# EAGLE design spinduino-apa102 (EAGLE 8.2.2)
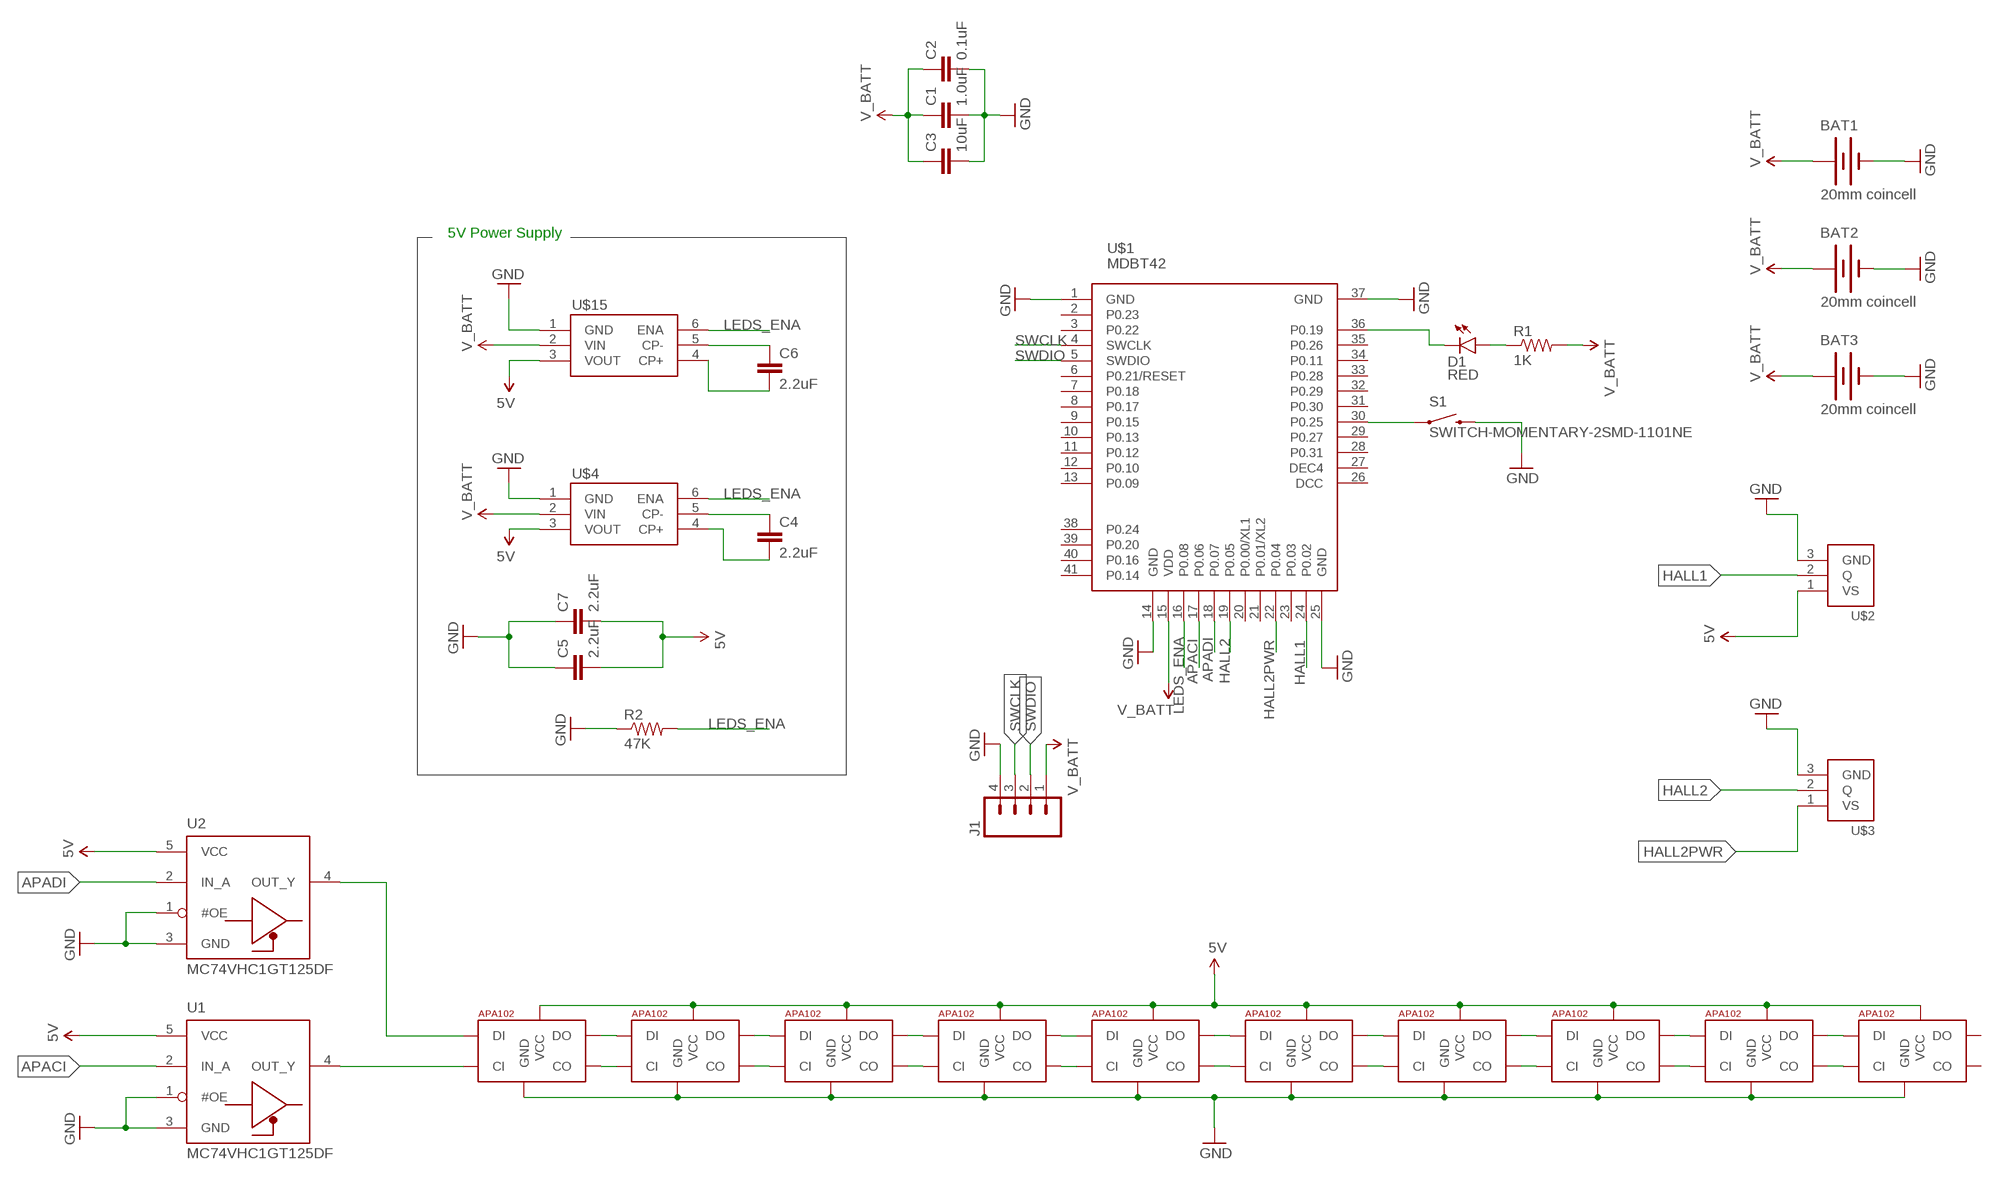
[diagram p0: schematic, sheet 1]

## Parts
BAT1  20mm coincell  BATTERY20MM_4LEGS  [BATTCON_20MM_4LEGS]
BAT2  20mm coincell  BATTERY20MM_4LEGS  [BATTCON_20MM_4LEGS]
BAT3  20mm coincell  BATTERY20MM_4LEGS  [BATTCON_20MM_4LEGS]
C1  1.0uF  1.0UF-16V-10%(0603)  [0603-CAP]
C2  0.1uF  0.1UF-25V-5%(0603)  [0603-CAP]
C3  10uF  10UF-6.3V-20%(0603)  [0603-CAP]
C4  2.2uF  2.2UF-10V-20%(0603)  [0603-CAP]
C5  2.2uF  10UF-6.3V-20%(0603)  [0603-CAP]
C6  2.2uF  2.2UF-10V-20%(0603)  [0603-CAP]
C7  2.2uF  10UF-6.3V-20%(0603)  [0603-CAP]
D1  RED  LED-RED0603  [LED-0603]
J1  M04LOCK  [1X04_LOCK]
R1  1K  1KOHM-1/10W-1%(0603)  [0603-RES]
R2  47K  1KOHM-1/10W-1%(0603)  [0603-RES]
S1  SWITCH-MOMENTARY-2SMD-1101NE  [TACTILE-SWITCH-1101NE]
U1  MC74VHC1GT125DF  [SOT353]
U2  MC74VHC1GT125DF  [SOT353]
U$1  MDBT42  [MDBT42]
U$2  TLE4946-2KSMD  [SC-59]
U$3  TLE4946-2KSMD  [SC-59]
U$4  TPS60150  [WSON6]
U$5  APA1022020  [APA102_2020]
U$6  APA1022020  [APA102_2020]
U$7  APA1022020  [APA102_2020]
U$8  APA1022020  [APA102_2020]
U$9  APA1022020  [APA102_2020]
U$10  APA1022020  [APA102_2020]
U$11  APA1022020  [APA102_2020]
U$12  APA1022020  [APA102_2020]
U$13  APA1022020  [APA102_2020]
U$14  APA1022020  [APA102_2020]
U$15  TPS60150  [WSON6]

## Nets
5V: C5.2 C7.2 U1.5(VCC) U2.5(VCC) U$2.1(VS) U$4.3(VOUT) U$5.V_CC(VCC) U$6.V_CC(VCC) U$7.V_CC(VCC) U$8.V_CC(VCC) U$9.V_CC(VCC) U$10.V_CC(VCC) U$11.V_CC(VCC) U$12.V_CC(VCC) U$13.V_CC(VCC) U$14.V_CC(VCC) U$15.3(VOUT)
APACI: U1.2(IN_A) U$1.17(P0.06)
APADI: U2.2(IN_A) U$1.18(P0.07)
GND: BAT1.NEGATIVE(-) BAT2.NEGATIVE(-) BAT3.NEGATIVE(-) C1.2 C2.2 C3.2 C5.1 C7.1 J1.4 R2.1 S1.2 U1.1(#OE) U1.3(GND) U2.1(#OE) U2.3(GND) U$1.1(GND) U$1.14(GND) U$1.25(GND) U$1.37(GND) U$2.3(GND) U$3.3(GND) U$4.1(GND) U$5.GND U$6.GND U$7.GND U$8.GND U$9.GND U$10.GND U$11.GND U$12.GND U$13.GND U$14.GND U$15.1(GND)
HALL1: U$1.24(P0.02) U$2.2(Q)
HALL2: U$1.19(P0.05) U$3.2(Q)
HALL2PWR: U$1.22(P0.04) U$3.1(VS)
LEDS_ENA: R2.2 U$1.16(P0.08) U$4.6(ENA) U$15.6(ENA)
N$1: U$10.C_IN(CI) U$11.CL_OUT(CO)
N$2: U$10.D_IN(DI) U$11.D_OUT(DO)
N$3: D1.C U$1.36(P0.19)
N$4: D1.A R1.1
N$5: U$5.D_IN(DI) U$6.D_OUT(DO)
N$6: U$5.C_IN(CI) U$6.CL_OUT(CO)
N$7: U$6.D_IN(DI) U$7.D_OUT(DO)
N$8: U$6.C_IN(CI) U$7.CL_OUT(CO)
N$9: U$7.D_IN(DI) U$8.D_OUT(DO)
N$10: U$7.C_IN(CI) U$8.CL_OUT(CO)
N$11: U$8.D_IN(DI) U$9.D_OUT(DO)
N$12: U$8.C_IN(CI) U$9.CL_OUT(CO)
N$13: U$9.D_IN(DI) U$10.D_OUT(DO)
N$14: U$9.C_IN(CI) U$10.CL_OUT(CO)
N$15: U$11.D_IN(DI) U$12.D_OUT(DO)
N$16: U$11.C_IN(CI) U$12.CL_OUT(CO)
N$17: U$12.D_IN(DI) U$13.D_OUT(DO)
N$18: U$12.C_IN(CI) U$13.CL_OUT(CO)
N$19: U$13.D_IN(DI) U$14.D_OUT(DO)
N$20: U$13.C_IN(CI) U$14.CL_OUT(CO)
N$21: S1.1 U$1.30(P0.25)
N$22: C4.2 U$4.4(CP+)
N$23: C4.1 U$4.5(CP-)
N$24: U2.4(OUT_Y) U$14.D_IN(DI)
N$25: U1.4(OUT_Y) U$14.C_IN(CI)
N$26: C6.1 U$15.5(CP-)
N$29: C6.2 U$15.4(CP+)
SWCLK: J1.3 U$1.4(SWCLK)
SWDIO: J1.2 U$1.5(SWDIO)
V_BATT: BAT1.POSITIVE@1(+) BAT1.POSITIVE@2(+) BAT1.POSITIVE@3(+) BAT1.POSITIVE@4(+) BAT2.POSITIVE@1(+) BAT2.POSITIVE@2(+) BAT2.POSITIVE@3(+) BAT2.POSITIVE@4(+) BAT3.POSITIVE@1(+) BAT3.POSITIVE@2(+) BAT3.POSITIVE@3(+) BAT3.POSITIVE@4(+) C1.1 C2.1 C3.1 J1.1 R1.2 U$1.15(VDD) U$4.2(VIN) U$15.2(VIN)
Unconnected: U$1.2(P0.23) U$1.3(P0.22) U$1.6(P0.21/RESET) U$1.7(P0.18) U$1.8(P0.17) U$1.9(P0.15) U$1.10(P0.13) U$1.11(P0.12) U$1.12(P0.10) U$1.13(P0.09) U$1.20(P0.00/XL1) U$1.21(P0.01/XL2) U$1.23(P0.03) U$1.26(DCC) U$1.27(DEC4) U$1.28(P0.31) U$1.29(P0.27) U$1.31(P0.30) U$1.32(P0.29) U$1.33(P0.28) U$1.34(P0.11) U$1.35(P0.26) U$1.38(P0.24) U$1.39(P0.20) U$1.40(P0.16) U$1.41(P0.14) U$5.CL_OUT(CO) U$5.D_OUT(DO)

## Notes on the sheet
- 5V Power Supply

## Library data of the parts
BAT1-BAT3 = ng-beacon:BATTERY: Battery Holders Various common sizes : AA, AAA, 18650 (PRT-12895), 20mm coin cell and 12mm coin cell. 20MM_4LEGS, BATT-10373; PROD_ID: BATT-10373
C1 = SparkFun-Capacitors:1.0UF-16V-10%(0603): CAP-00868; PROD_ID: CAP-00868
C2 = SparkFun-Capacitors:0.1UF-25V-5%(0603): CAP-08604; PROD_ID: CAP-08604
C3 = SparkFun-Capacitors:10UF-6.3V-20%(0603): CAP-11015; PROD_ID: CAP-11015
C4 C6 = SparkFun-Capacitors:2.2UF-10V-20%(0603): CAP-07888; PROD_ID: CAP-07888
C5 C7 = SparkFun-Capacitors:10UF-6.3V-20%(0603): CAP-11015; PROD_ID: CAP-11015; VALUE: 10uF
D1 = SparkFun-LED:LED-RED: Assorted Red LEDs LilyPad 1206- DIO-09912 1206- DIO-00809 0603- DIO-00819 "SMART" means more efficient and expensive; PROD_ID: DIO-00819
J1 = ng-beacon:M04: Header 4 Standard 4-pin 0.1" header. Use with straight break away headers (SKU : PRT-00116), right angle break away headers (PRT-00553), swiss pins (PRT-00743), machine pins (PRT-00117), and female headers (PRT-00115). Molex polarized connector foot print use with SKU : PRT-08231 with associated crimp pins and housings. 1MM SMD Version SKU: PRT-10208; PROD_ID: CONN-09696
R1 = SparkFun-Resistors:1KOHM-1/10W-1%(0603): RES-07856; PROD_ID: RES-07856
R2 = SparkFun-Resistors:1KOHM-1/10W-1%(0603): RES-07856; PROD_ID: RES-07856; VALUE: 1K
S1 = SparkFun-Electromechanical:SWITCH-MOMENTARY-2: Various NO switches- pushbuttons, reed, etc; PROD_ID: SWCH-00815
U1 U2 = uri:MC74VHC1GT125: OnSemi's MC74VHC1GT125 Noninverting Buffer / CMOS Logic Level Shifter with LSTTL-Compatible Inputs Description: The MC74VHC1GT125 is a single gate noninverting buffer fabricated with silicon gate CMOS technology. It achieves high speed operation similar to equivalent Bipolar Schottky TTL while maintaining CMOS low power dissipation. The MC74VHC1GT125 requires the 3-state control input (OE) to be set High to place the output into the high impedance state. The device input is compatible with TTL-type input thresholds and the output has a full 5 V CMOS level output swing. The input protection circuitry on this device allows overvoltage tolerance on the input, allowing the device to be used as a logic-level translator from 3.0 V CMOS logic to 5.0 V CMOS Logic or from 1.8 V CMOS logic to 3.0 V CMOS Logic while operating at the high-voltage power supply. The MC74VHC1GT125 input structure provides protection when voltages up to 7 V are applied, regardless of the supply voltage. This allows the MC74VHC1GT125 to be used to interface 5 V circuits to 3 V circuits. The output structures also provide protection when VCC = 0 V. These input and output structures help prevent device destruction caused by supply voltage - input/output voltage mismatch, battery backup, hot insertion, etc. Features: High Speed: tPD = 3.5 ns (Typ) at VCC = 5 V Low Power Dissipation: ICC = 1 A (Max) at TA = 25°C TTL-Compatible Inputs: VIL = 0.8 V; VIH = 2.0 V CMOS-Compatible Outputs: VOH > 0.8 VCC; VOL < 0.1 VCC @Load Power Down Protection Provided on Inputs and Outputs Balanced Propagation Delays Pin and Function Compatible with Other Standard Logic Families Chip Complexity: FETs = 62; Equivalent Gates = 16 Please send any comments to: messi@users.sourceforge.net
U$1 = MDBT42:MDBT42: Raytac Corporation MDBT42-512K, MDBT42-P512K Bluetooth Low Energy Module based on Noridc nRF52832 Source: Raytac datasheet
U$2 U$3 = uri:TLE4946-2K: TLE4946-2K High Precision Hall Effect Latch Datasheet <https://www.infineon.com/dgdl/Infineon-TLE4946_2K-DS-v01_00-en.pdf?fileId=db3a30431f848401011fbc925c48637f>
U$4 U$15 = uri:TPS60150: TPS60150 - 5-V, 140-mA Charge-Pump Datasheet <http://www.ti.com/lit/ds/symlink/tps60150.pdf>
U$5-U$14 = jos-ph:APA102: APA102C 5050 RGB LED -- Adafruit DotStar Single LED Pixel Product Page: https://www.adafruit.com/products/2343 Datasheet: https://cdn-shop.adafruit.com/product-files/2343/APA102C.pdf

## Board
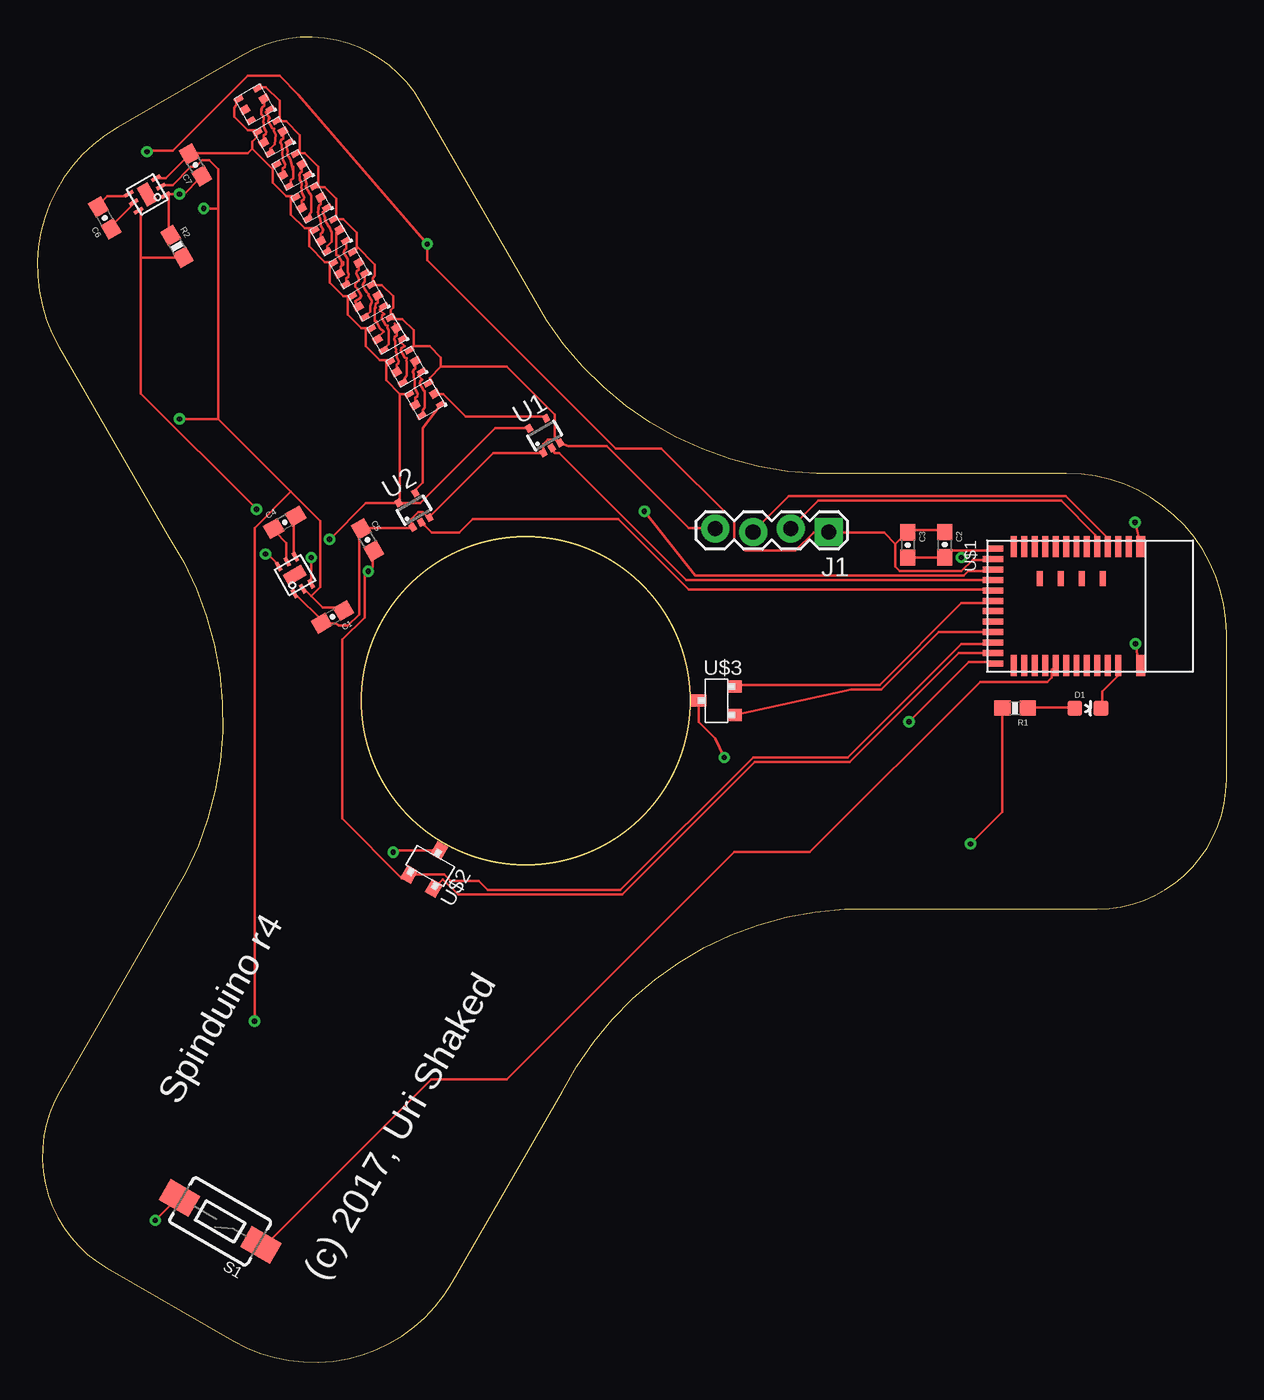
[diagram p1: board, top side]
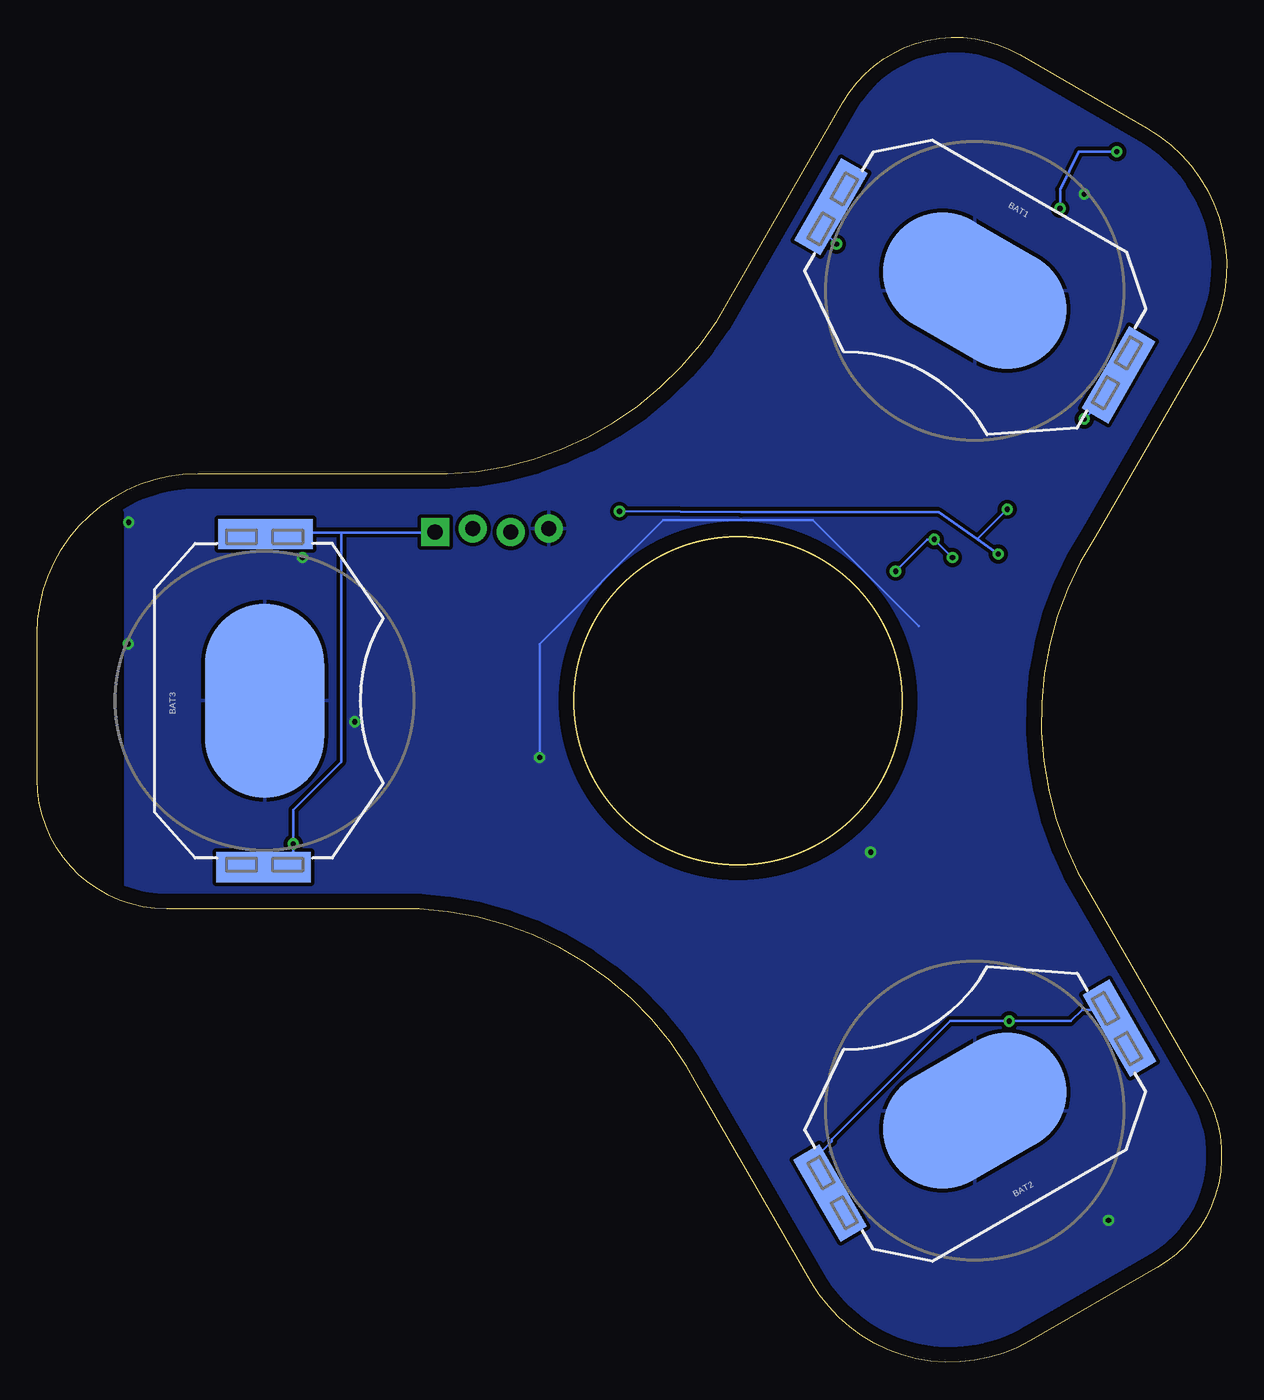
[diagram p2: board, bottom side, seen from below]

Size 79.74 x 88.88 mm. Coordinates in mm from the lower left corner, seen from the top.
Outline: 54.14,30.4 71.07,30.4 arc90 79.74,39.08 79.74,48.87 arc90 68.99,59.61 54.24,59.61 arc-60 34.16,69.88 25.69,84.54 arc90 13.85,87.72 5.37,82.82 arc90 1.43,68.14 8.81,55.36 arc-60 9.96,32.84 1.5,18.18 arc90 4.67,6.33 13.15,1.43 arc90 27.83,5.37 35.21,18.15 arc-60 54.14,30.4
Outline: circle at 32.75,44.37 radius 11
Copper layers (1*16): Top 0.035mm / dielectric 1.5mm / Bottom 0.035mm
Design rules "default *": minimum track width 6mil, minimum drill 0.35mm, track to track 6mil, track to pad 6mil, pad to pad 6mil, via to via 6mil, smd to smd 6mil, copper to edge 40mil, drill to drill 6mil, minimum pad ring 10mil, minimum via ring 8mil, stop-mask expansion 4mil, vias tented up to drill 0.35mm, thermal gap 10mil
bRestrict: area 74.3,31.6 to 79.7,57.1

### Footprints (pad centres in the part's own frame; a part is rotated, then mirrored left to right if it is on the bottom)
BATTCON_20MM_4LEGS = smd 13 x 8: NEGATIVE 0,0 | smd 2.032 x 3.175: POSITIVE@1 -11.176,1.651; POSITIVE@2 -11.176,-1.524; POSITIVE@3 11.176,1.524; POSITIVE@4 11.176,-1.651
0603-CAP = smd 1.1 x 1: 1 -0.85,0; 2 0.85,0
LED-0603 = smd 1 x 1: A 0,-0.877; C 0,0.877
1X04_LOCK = drill 1.016 pad 1.88 square: 1 0,0.127 | drill 1.016 pad 1.88: 2 2.54,-0.127; 3 5.08,0.127; 4 7.62,-0.127
0603-RES = smd 1.1 x 1: 1 -0.85,0; 2 0.85,0
TACTILE-SWITCH-1101NE = smd 2.3 x 1.6: 1 -3.15,0; 2 3.15,0
SOT353 = smd 0.4 x 0.5: 1 -0.65,-0.95; 2 0,-0.95; 3 0.65,-0.95; 4 0.65,0.95; 5 -0.65,0.95
MDBT42 = smd 1.4 x 0.6: 1 -4,4.4; 37 4,4.4 | smd 1.4 x 0.4: 2 -4,3.6; 3 -4,2.9; 4 -4,2.2; 5 -4,1.5; 6 -4,0.8; 7 -4,0.1; 8 -4,-0.6; 9 -4,-1.3; 10 -4,-2; 11 -4,-2.7; 12 -4,-3.4; 13 -4,-4.1; 26 4,-4.1; 27 4,-3.4; 28 4,-2.7; 29 4,-2; 30 4,-1.3; 31 4,-0.6; 32 4,0.1; 33 4,0.8; 34 4,1.5; 35 4,2.2; 36 4,2.9 | smd 0.4 x 1.1: 14 -3.85,-5.35; 25 3.85,-5.35 | smd 0.4 x 1.4: 15 -3.15,-5.5; 16 -2.45,-5.5; 17 -1.75,-5.5; 18 -1.05,-5.5; 19 -0.35,-5.5; 20 0.35,-5.5; 21 1.05,-5.5; 22 1.75,-5.5; 23 2.45,-5.5; 24 3.15,-5.5 | smd 1 x 0.4: 38 -1.85,1.85; 39 -1.85,0.45; 40 -1.85,-0.95; 41 -1.85,-2.35
SC-59 = smd 0.8 x 1: 1 -0.95,-1.2; 2 0.95,-1.2; 3 0,1.2
WSON6 = smd 0.65 x 0.25: 1 -1.05,0.65; 2 -1.05,0; 3 -1.05,-0.65; 4 1.05,-0.65; 5 1.05,0; 6 1.05,0.65 | smd 0.8 x 1.4: THERMAL 0,0
APA102_2020 = smd 0.6 x 0.5: C_IN 0.25,1; CL_OUT 1.75,1 | smd 0.6 x 0.35: D_IN 0.25,1.825; D_OUT 1.75,1.825; GND 0.25,0.175; V_CC 1.75,0.175

### Placement (x,y rotation side)
BAT1  16.88,71.87 330 bottom
BAT2  16.88,16.88 210 bottom
BAT3  64.5,44.37 90 bottom
C1  19.8,49.99 210 top
C2  60.84,54.83 270 top
C3  58.37,54.82 270 top
C4  16.59,56.34 30 top
C5  22.14,55.16 300 top
C6  4.52,76.76 120 top
C7  10.61,80.3 120 top
D1  70.44,43.86 270 top
J1  53.07,55.8 180 top
R1  65.56,43.87 180 top
R2  9.36,74.85 300 top
S1  12.26,9.45 150 top
U1  34.02,62.15 30 top
U2  25.26,57.15 30 top
U$1  69.58,50.72 270 top
U$2  26.35,33.29 330 top
U$3  45.55,44.37 90 top
U$4  17.27,52.79 120 top
U$5  14.93,85.75 210 top
U$6  16.2,83.55 210 top
U$7  17.47,81.35 210 top
U$8  18.74,79.15 210 top
U$9  20.01,76.95 210 top
U$10  21.28,74.75 210 top
U$11  22.55,72.55 210 top
U$12  23.82,70.35 210 top
U$13  25.09,68.15 210 top
U$14  26.36,65.95 210 top
U$15  7.37,78.33 210 top

### Tracks (layer width: path | path; a pad name or v marks a point on that pad's centre or on a via)
5V  (via drill 0.35)
  Top 0.152: v18.38,53.98 18.38,52.3 U$4.3 | v19.6,55.19 22.03,57.63 24.17,57.63 U2.5 | C5.2 22.49,54.28 22.49,53.37 v22.19,53.06 21.95,52.96 21.95,49.96 20.45,48.46 20.45,36.46 24.45,32.46 U$2.1 27.29,32.73 27.74,32.27 29.62,32.27 30.21,31.67 39.1,31.67 47.99,40.56 54.34,40.56 61.96,48.18 63.99,48.18 | U$15.3 8.01,79.43 8.62,79.43 10.15,80.95 C7.2 10.3,81.1 14.11,81.1 14.41,81.41 | U1.5 32.86,62.66 30.72,62.66 25.69,57.63 24.32,57.63 U2.5 | 17.01,78.21 16.7,78.21 15.79,79.12 15.79,80.04 | 17.01,78.21 17.16,78.21 U$8.V_CC | 15.79,80.04 15.94,80.19 U$7.V_CC | 18.22,76.07 17.92,76.07 17.01,76.99 17.01,78.21 | 18.22,76.07 18.53,76.07 U$9.V_CC | 19.6,73.79 19.29,73.79 18.22,74.85 18.22,76.07 | 19.6,73.79 19.75,73.79 U$10.V_CC | 20.82,71.5 20.51,71.5 19.6,72.42 19.6,73.79 | 20.82,71.5 20.97,71.5 U$11.V_CC 20.82,71.5 | 22.03,69.37 21.73,69.37 20.82,70.28 20.82,71.5 | 22.03,69.37 22.34,69.37 U$12.V_CC | 23.41,67.23 22.95,67.23 22.03,68.15 22.03,69.37 | 23.41,67.23 23.56,67.23 U$13.V_CC | 24.32,64.95 24.78,64.95 U$14.V_CC | 24.32,64.95 23.41,65.86 23.41,67.23 | 14.41,81.41 14.41,81.86 14.72,82.17 14.72,82.47 U$6.V_CC 14.72,82.63 14.11,82.63 13.2,83.54 13.2,84.15 13.35,84.3 13.35,84.61 U$5.V_CC | 15.79,80.04 14.41,81.41 | 24.32,64.95 24.32,57.79 U2.5
  Bottom 0.152: v18.38,53.98 v19.6,55.19 20.05,55.19 v22.19,53.06
APACI
  Top 0.152: U1.2 34.68,60.99 34.99,60.99 43.52,52.45 63.94,52.45 U$1.17
APADI
  Top 0.152: U2.2 26,56.11 26.45,55.65 28.28,55.65 29.2,56.57 38.95,56.57 43.68,51.84 63.94,51.84 U$1.18
GND  (via drill 0.35)
  Top 0.152: C3.2 58.46,53.98 60.74,53.98 C2.2 60.9,54.13 61.2,54.43 61.96,54.43 | 61.96,54.43 64.1,54.43 U$1.14 | v73.64,48.19 73.85,46.81 U$1.37 | v73.61,56.35 74,54.74 U$1.1 | v61.96,53.98 61.96,54.43 | J1.4 45.35,55.96 43.68,55.96 38.19,61.44 35.6,61.44 U1.3 34.99,61.75 34.84,61.9 34.68,61.9 | U$3.3 44.35,42.93 45.45,41.83 v46.06,40.56 | U$2.3 23.98,34.33 v23.86,34.21 | C7.1 10.91,79.43 9.84,78.36 v9.54,78.36 8.62,78.36 U$15.1 8.83,78.34 8.83,75.71 R2.1 | U$4.1 17.31,51.54 19.14,49.71 C1.2 19.14,49.56 20.05,49.56 20.21,49.4 20.82,49.4 21.58,50.17 21.58,55.8 C5.1 21.73,55.96 25.08,55.96 U2.1 25.08,56.11 25.08,56.57 25.54,57.02 25.84,57.02 26.15,56.72 U2.3 26.3,56.72 30.57,60.99 33.92,60.99 U1.1 33.92,61.14 33.92,61.6 34.23,61.9 34.68,61.9 | v7.91,9.53 9.54,11.15 S1.2 | v58.45,42.96 62.45,46.96 63.95,46.96 U$1.25 | 25.24,68.15 25.24,69.22 24.47,69.98 23.71,69.98 U$12.GND 23.71,70.13 23.71,70.59 23.86,70.74 23.86,71.5 23.1,72.26 22.49,72.26 U$11.GND 22.49,72.42 22.49,72.72 22.64,72.87 22.64,73.64 21.43,74.85 | 25.24,68.15 25.08,68 U$13.GND | 27.06,66.78 26.3,66.02 26.3,65.71 U$14.GND | 27.06,66.78 27.06,67.39 26.3,68.15 25.24,68.15 | 20.05,76.68 20.51,76.68 21.43,75.77 21.43,74.85 | 20.05,76.68 19.9,76.68 U$9.GND 20.05,76.68 | 21.43,74.85 21.43,74.7 21.27,74.55 U$10.GND | 18.83,78.82 19.29,78.82 20.05,78.05 20.05,76.68 | 18.83,78.82 18.68,78.82 U$8.GND 18.83,78.82 | 17.62,81.1 17.92,81.1 18.83,80.19 18.83,78.82 | 17.62,81.1 17.46,81.1 U$7.GND 17.62,81.1 | 16.24,83.24 16.7,83.24 17.62,82.32 17.62,81.1 | 16.24,83.24 16.09,83.24 U$6.GND 16.24,83.24 | 16.24,83.24 16.24,84.61 15.33,85.52 14.87,85.52 U$5.GND
  Top 0.152: 27.06,66.78 31.48,66.78 34.68,63.58 34.68,61.9
  Bottom 0.152: 20.65,49.39 27.74,56.48 37.77,56.48 46.06,48.18 v46.06,40.56
  pour Bottom (isolate 0.254): 54.14,30.4 71.07,30.4 arc90 79.74,39.08 79.74,48.87 arc90 68.99,59.61 54.24,59.61 arc-60 34.16,69.88 25.69,84.54 arc90 13.85,87.72 5.37,82.82 arc90 1.44,68.14 8.81,55.36 arc-60 9.96,32.84 1.5,18.18 arc90 4.67,6.33 13.15,1.44 arc90 27.83,5.37 35.21,18.15 arc-60
HALL1
  Top 0.152: U$2.2 27.19,32.39 27.44,32.15 28.21,31.37 39.23,31.37 48.12,40.26 54.47,40.26 61.78,47.57 U$1.24
HALL2
  Top 0.152: U$3.2 46.88,45.44 56.48,45.44 61.96,50.93 63.94,50.93 U$1.19
HALL2PWR
  Top 0.152: U$3.1 54.57,45.14 56.6,45.14 60.44,48.97 U$1.22
LEDS_ENA  (via drill 0.35)
  Top 0.152: v40.71,57.08 44.13,52.76 62.12,52.76 62.42,53.06 63.94,53.06 U$1.16 | U$4.6 16.2,53.46 15.45,54.21 v15.3,54.21 | 6.95,74.09 6.95,64.96 v14.7,57.21 | 6.95,74.09 6.95,77.21 U$15.6 | 6.95,74.09 9.7,74.09 R2.2
  Bottom 0.152: v40.71,57.08 32.55,57.02 19.29,57.02 16.71,55.21 | v15.3,54.21 16.71,55.21 | v14.7,57.21 16.7,55.21 16.71,55.21
N$1
  Top 0.152: U$10.C_IN 21.56,73.27 21.43,73.2 21.38,73.01 21.56,72.7 21.56,72.55 21.32,72.31 21.32,72.14 21.44,72.02 21.71,71.56 21.66,71.37 21.32,71.18 21.32,71.12 21.58,70.86 U$11.CL_OUT
N$2
  Top 0.152: U$10.D_IN 21.97,72.48 21.88,72.43 21.83,72.24 21.97,71.99 22.1,71.78 22.22,71.66 22.2,71.59 22.42,71.22 22.42,71.12 22.37,70.96 | 22.37,70.96 | 22.37,70.96 22.34,70.84 22.32,70.78 22.32,70.48 U$11.D_OUT
N$3
  Top 0.152: D1.C 71.41,43.92 71.41,44.98 72.48,46.05 72.48,46.66 U$1.36
N$4
  Top 0.152: D1.A 69.43,43.92 66.54,43.92 R1.1
N$5
  Top 0.152: U$6.D_OUT 15.63,81.1 15.63,81.41 15.94,81.71 16,82.33 15.85,82.59 15.89,82.74 15.75,82.78 15.48,83.24 15.53,83.43 15.59,83.46 15.33,83.85 15.48,84 U$5.D_IN
N$6
  Top 0.152: U$5.C_IN 15.21,84.27 15.08,84.2 15.03,84.01 15.04,83.99 15.02,83.97 15.02,83.88 15.01,83.78 15.02,83.75 15.02,83.72 15.09,83.65 15.2,83.49 15.2,83.38 15.15,83.2 15.2,83.12 15.19,82.85 15.36,82.55 15.31,82.37 15.19,82.3 U$6.CL_OUT
N$7
  Top 0.152: 17.16,80.19 17.16,79.93 | 17.16,79.93 17.16,79.43 17.01,79.27 17.01,78.97 U$7.D_OUT | 16.71,81.57 16.7,81.56 | 16.71,81.57 16.85,81.71 U$6.D_IN | 17.16,79.93 16.95,80.69 16.75,81.04 16.8,81.23 16.71,81.57
N$8
  Top 0.152: U$6.C_IN 16.48,82.07 16.35,82 16.3,81.81 16.38,81.67 16.38,81.48 16.4,81.43 16.44,81.39 16.44,81.08 16.42,81 16.47,80.92 16.46,80.65 16.63,80.35 16.58,80.17 16.46,80.1 U$7.CL_OUT
N$9
  Top 0.152: U$8.D_OUT 18.22,76.84 18.22,76.99 18.38,77.14 18.38,78.21 18.32,78.37 18.29,78.38 18.02,78.84 18.07,79.03 17.92,79.43 18.07,79.58 U$7.D_IN
N$10
  Top 0.152: U$7.C_IN 17.75,79.87 17.62,79.8 17.57,79.61 17.62,79.54 17.62,79.49 17.59,79.44 17.62,79.37 17.62,79.3 17.66,79.26 17.74,79.04 17.74,78.98 17.69,78.8 17.74,78.72 17.73,78.45 17.9,78.15 17.85,77.97 17.73,77.9 U$8.CL_OUT
N$11
  Top 0.152: U$9.D_OUT 19.44,74.55 19.44,74.85 19.75,75.16 19.75,75.77 19.57,76.17 19.56,76.18 19.29,76.64 19.31,76.75 19.14,77.14 19.29,77.29 U$8.D_IN
N$12
  Top 0.152: U$8.C_IN 19.02,77.67 18.89,77.6 18.84,77.41 18.87,77.36 18.83,77.27 18.83,77.2 18.81,77.13 18.83,77.08 18.83,77.01 18.98,76.68 18.96,76.6 | 18.96,76.6 | U$9.CL_OUT 19,75.7 19.12,75.77 19.17,75.95 19,76.25 19.01,76.52 18.96,76.6
N$13
  Top 0.152: U$9.D_IN 20.7,74.68 20.61,74.63 20.56,74.44 20.82,73.99 20.82,73.11 20.89,72.98 20.84,72.79 20.7,72.71 20.7,72.32 U$10.D_OUT
N$14
  Top 0.152: U$10.CL_OUT 20.36,73.03 20.36,73.48 20.51,73.64 20.51,73.79 20.44,73.76 | U$9.C_IN 20.21,75.92 20.05,75.77 20.05,74.25 20.17,74.22 20.44,73.76 | 20.44,73.76 20.42,73.65
N$15
  Top 0.152: 22.95,70.59 23.1,70.74 23.16,70.79 | U$12.D_OUT 23.25,68 23.56,68.3 23.56,69.24 23.47,69.39 23.51,69.54 23.37,69.58 23.1,70.04 23.15,70.23 23.25,70.29 22.95,70.58 | 23.16,70.79 U$11.D_IN | 22.95,70.58 | 22.95,70.58 22.96,70.59 22.97,70.59 23.16,70.79
N$16
  Top 0.152: U$11.C_IN 22.83,71.07 22.7,71 22.65,70.82 22.69,70.76 22.64,70.71 22.64,69.84 22.61,69.85 22.71,69.82 22.98,69.37 23.22,69.13 22.8,68.71 U$12.CL_OUT
N$17
  Top 0.152: U$13.D_OUT 24.63,65.71 24.63,66.02 24.78,66.17 24.78,67.13 24.74,67.2 24.78,67.33 24.78,67.34 24.64,67.38 24.37,67.84 24.42,68.03 24.63,68.15 24.32,68.45 24.47,68.61 U$12.D_IN
N$18
  Top 0.152: 23.97,69.67 24.1,69.54 U$12.C_IN 24.1,68.87 23.97,68.8 23.92,68.62 24.02,68.45 24.02,68.06 24.08,67.94 24.04,67.8 24.1,67.69 24.1,67.42 24.25,67.16 24.2,66.97 24.1,66.91 24.1,66.44 U$13.CL_OUT
N$19
  Top 0.152: U$14.D_OUT 25.84,63.58 25.84,63.88 26,64.03 26,64.69 26,64.95 26,65.15 25.91,65.18 25.64,65.64 25.69,65.83 25.81,65.9 25.54,66.17 25.69,66.32 U$13.D_IN
N$20
  Top 0.152: U$14.CL_OUT 25.34,64.7 25.47,64.77 25.52,64.96 25.31,65.33 25.31,65.97 25.24,66.04 25.24,66.29 25.25,66.31 25.19,66.42 25.24,66.6 25.34,66.66 25.34,67.13 U$13.C_IN
N$21
  Top 0.152: U$1.30 68.01,46.45 68.01,45.93 67.73,45.64 63.23,45.64 51.8,34.21 46.72,34.21 31.48,18.97 26.4,18.97 15.3,7.87 S1.1
N$22
  Top 0.152: U$4.4 17.2,54.21 17.2,56.71 C4.2
N$23
  Top 0.152: U$4.5 16.7,53.71 16.7,54.96 15.95,55.71 C4.1
N$24
  Top 0.152: U$14.D_IN 25.84,62.66 25.84,59 25.39,58.55 25.39,58.4 U2.4
N$25
  Top 0.152: U1.4 34.07,63.42 28.74,63.42 27.22,64.95 26.76,64.95 U$14.C_IN
N$26
  Top 0.152: U$15.5 6.45,77.71 4.95,76.21 C6.1
N$29
  Top 0.152: U$15.4 5.95,78.21 4.7,78.21 4.2,77.71 C6.2
SWCLK
  Top 0.152: U$1.4 71.72,54.74 71.72,55.35 68.97,58.09 50.38,58.09 48.1,55.8 J1.3
SWDIO
  Top 0.152: U$1.5 70.96,54.74 70.96,55.5 68.67,57.79 52.36,57.79 50.53,55.96 J1.2
V_BATT  (via drill 0.35)
  Top 0.152: v62.57,34.77 64.71,36.91 64.71,43.76 R1.2 | C2.1 60.74,55.8 58.46,55.8 C3.1 58.31,55.65 57.54,54.89 | 57.54,54.89 57.54,53.37 57.85,53.06 61.96,53.06 62.73,53.82 63.94,53.82 U$1.15 | 57.54,54.89 56.78,55.65 53.12,55.65 J1.1 52.97,55.65 52.06,55.65 50.84,54.43 47.49,54.43 46.72,55.19 46.72,56.41 41.85,61.29 38.8,61.29 26.15,73.94 v26.15,75.01 17.51,85.01 16.24,86.28 14.11,86.28 9.08,81.26 7.4,81.26 v7.35,81.2 | 12.13,63.27 17.01,58.4 | v9.54,63.27 12.13,63.27 | v14.57,22.89 14.57,55.96 17.01,58.4 | 18.38,51.38 19.14,50.62 20.36,50.62 20.51,50.47 C1.1 | 18.38,51.38 17.92,51.84 U$4.2 | 18.38,51.38 18.99,51.99 18.99,56.41 17.01,58.4 | 12.13,77.39 12.13,80.04 11.52,80.65 11.06,80.65 10.76,80.34 10.6,80.34 10.45,80.19 10.3,80.19 9.08,78.97 8.32,78.97 U$15.2 | 12.13,77.39 12.13,63.27 | 12.13,77.39 v11.16,77.39
  Bottom 0.152: BAT3.POSITIVE@1 66.08,33.25 63.03,33.25 BAT3.POSITIVE@2 62.88,33.25 62.57,33.55 v62.57,34.77 62.57,37.06 59.37,40.26 59.37,55.65 | BAT3.POSITIVE@3 65.93,55.65 62.88,55.65 BAT3.POSITIVE@4 62.73,55.65 59.37,55.65 | 59.37,55.65 53.12,55.65 J1.1 | BAT2.POSITIVE@1 6.49,21.06 6.49,22.28 7.86,23.65 BAT2.POSITIVE@2 8.01,23.65 9.69,23.65 10.45,22.89 v14.57,22.89 18.53,22.89 26.45,14.96 26.45,14.81 27.37,13.89 27.37,12.83 BAT2.POSITIVE@4 27.37,12.68 25.84,11.15 25.84,10.08 BAT2.POSITIVE@3 | BAT1.POSITIVE@1 25.84,78.82 27.22,77.45 27.22,76.23 BAT1.POSITIVE@2 27.22,76.07 v26.15,75.01 | v9.54,63.27 8.01,64.8 BAT1.POSITIVE@4 8.01,64.95 6.49,66.47 6.49,67.54 BAT1.POSITIVE@3 | v7.35,81.2 9.89,81.2 11.16,78.66 v11.16,77.39

### Text on the board
tNames: Spinduino r4 | (c) 2017, Uri Shaked